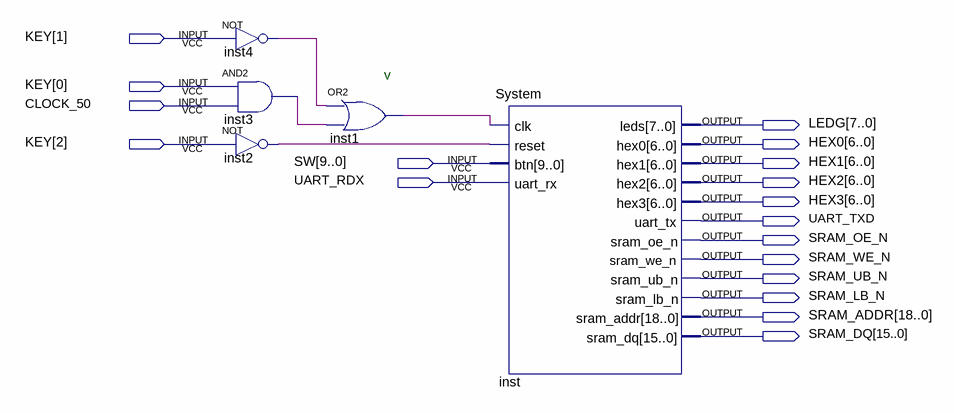
[diagram p0: schematic sheet]
// Quartus schematic lm32.bdf as structural Verilog: 5 symbols, 18 pins
module lm32 (
  input  [2:0] KEY,
  input  CLOCK_50,
  input  [9:0] SW,
  input  UART_RDX,
  output [7:0] LEDG,
  output [6:0] HEX0,
  output [6:0] HEX1,
  output [6:0] HEX2,
  output [6:0] HEX3,
  output UART_TXD,
  output SRAM_OE_N,
  output SRAM_WE_N,
  output SRAM_UB_N,
  output SRAM_LB_N,
  output [18:0] SRAM_ADDR,
  output [15:0] SRAM_DQ
);

  wire inst1_out, inst2_out, inst3_out, inst4_out;

  not inst4 (inst4_out, KEY[1]);
  and inst3 (inst3_out, KEY[0], CLOCK_50);
  not inst2 (inst2_out, KEY[2]);
  or inst1 (inst1_out, inst4_out, inst3_out);
  System inst (
    .clk(inst1_out), .reset(inst2_out), .btn(SW), .uart_rx(UART_RDX), .leds(LEDG), .hex0(HEX0), .hex1(HEX1),
    .hex2(HEX2), .hex3(HEX3), .uart_tx(UART_TXD), .sram_oe_n(SRAM_OE_N), .sram_we_n(SRAM_WE_N),
    .sram_ub_n(SRAM_UB_N), .sram_lb_n(SRAM_LB_N), .sram_addr(SRAM_ADDR), .sram_dq(SRAM_DQ));

  // Notes on the sheet:
  //   v
endmodule
